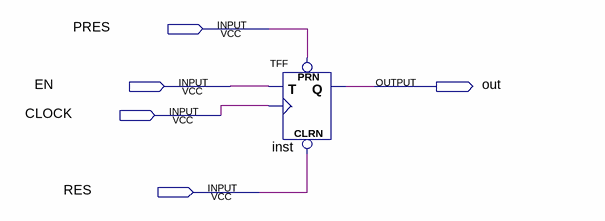
[diagram p0: schematic sheet]
// Quartus schematic test_TFF.bdf as structural Verilog: 1 symbols, 5 pins
module test_TFF (
  input  PRES,
  input  EN,
  input  CLOCK,
  input  RES,
  output out
);

  TFF inst (.PRN(PRES), .CLRN(RES), .T(EN), .CLK(CLOCK), .Q(out));
endmodule
